# EAGLE design BaseProximity (EAGLE 8.1.0)
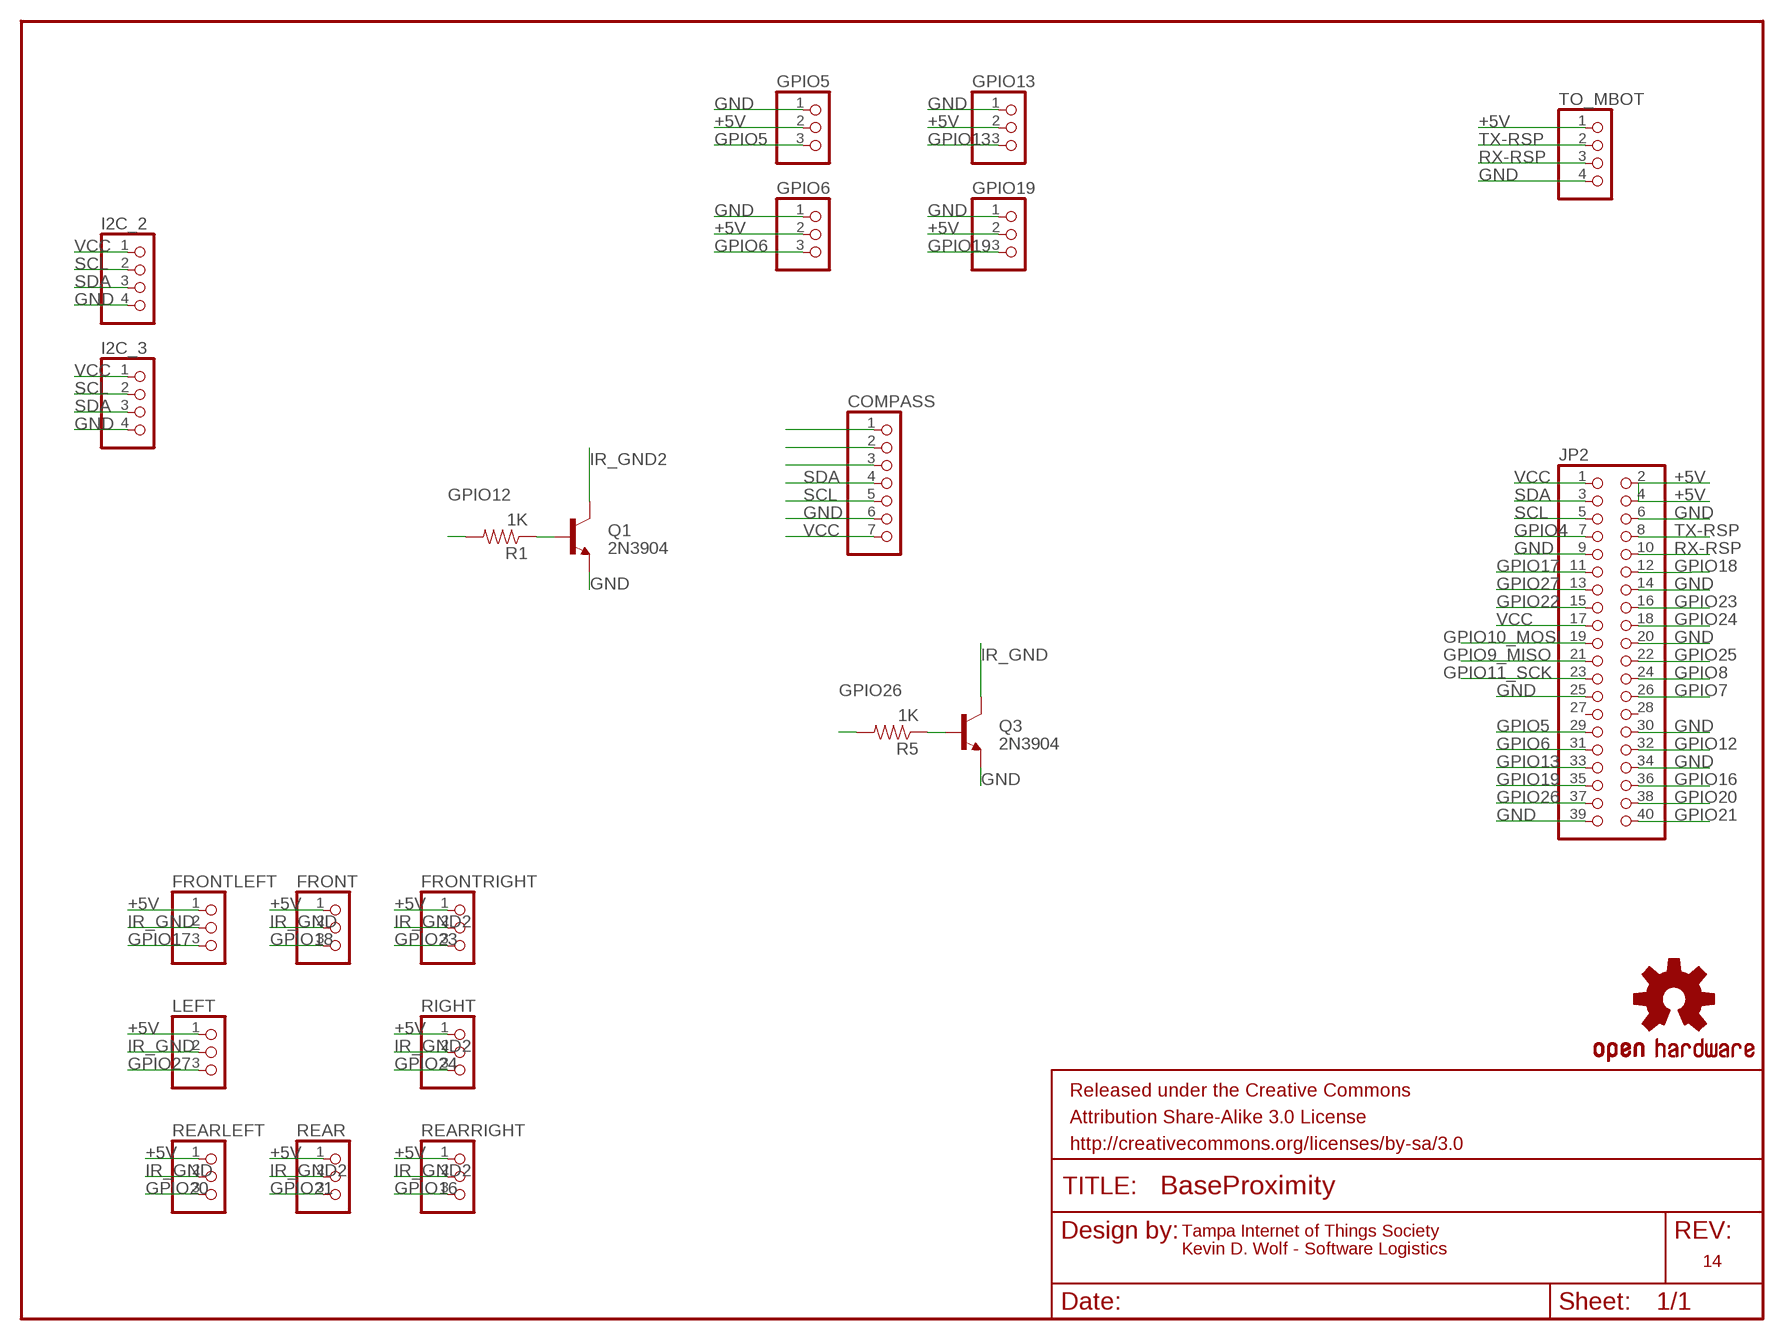
[diagram p0: schematic, sheet 1]

## Parts
COMPASS  PINHD-1X7  [1X07]
FRAME1  FRAME-LETTER  [CREATIVE_COMMONS]
FRONT  PINHD-1X3  [1X03]
FRONTLEFT  PINHD-1X3  [1X03]
FRONTRIGHT  PINHD-1X3  [1X03]
GPIO5  PINHD-1X3  [1X03]
GPIO6  PINHD-1X3  [1X03]
GPIO13  PINHD-1X3  [1X03]
GPIO19  PINHD-1X3  [1X03]
I2C_2  PINHD-1X4  [1X04]
I2C_3  PINHD-1X4  [1X04]
JP2  PINHD-2X20  [2X20]
LEFT  PINHD-1X3  [1X03]
Q1  2N3904  TRANSISTOR_NPN2N3904-EZ  [TO-92-EZ]
Q3  2N3904  TRANSISTOR_NPN2N3904-EZ  [TO-92-EZ]
R1  1K  1KOHM-1/4W-1%(PTH)HORIZ-KIT  [AXIAL-0.3EZ]
R5  1K  1KOHM-1/4W-1%(PTH)HORIZ-KIT  [AXIAL-0.3EZ]
REAR  PINHD-1X3  [1X03]
REARLEFT  PINHD-1X3  [1X03]
REARRIGHT  PINHD-1X3  [1X03]
RIGHT  PINHD-1X3  [1X03]
TO_MBOT  PINHD-1X4  [1X04]
U$3  OSHW-LOGOS  [OSHW-LOGO-S]

## Nets
+5V: FRONT.1 FRONTLEFT.1 FRONTRIGHT.1 GPIO5.2 GPIO6.2 GPIO13.2 GPIO19.2 JP2.2 JP2.4 LEFT.1 REAR.1 REARLEFT.1 REARRIGHT.1 RIGHT.1 TO_MBOT.1
GND [vcc]: COMPASS.6 GPIO5.1 GPIO6.1 GPIO13.1 GPIO19.1 I2C_2.4 I2C_3.4 JP2.6 JP2.9 JP2.14 JP2.20 JP2.25 JP2.30 JP2.34 JP2.39 Q1.1(E) Q3.1(E) TO_MBOT.4
GPIO4: JP2.7
GPIO5: GPIO5.3 JP2.29
GPIO6: GPIO6.3 JP2.31
GPIO7: JP2.26
GPIO8: JP2.24
GPIO9_MISO: JP2.21
GPIO10_MOSI: JP2.19
GPIO11_SCK: JP2.23
GPIO12: JP2.32 R1.P$2
GPIO13: GPIO13.3 JP2.33
GPIO16: JP2.36 REARRIGHT.3
GPIO17: FRONTLEFT.3 JP2.11
GPIO18: FRONT.3 JP2.12
GPIO19: GPIO19.3 JP2.35
GPIO20: JP2.38 REARLEFT.3
GPIO21: JP2.40 REAR.3
GPIO22: JP2.15
GPIO23: FRONTRIGHT.3 JP2.16
GPIO24: JP2.18 RIGHT.3
GPIO25: JP2.22
GPIO26: JP2.37 R5.P$2
GPIO27: JP2.13 LEFT.3
IR_GND: FRONT.2 FRONTLEFT.2 LEFT.2 Q3.3(C) REARLEFT.2
IR_GND2: FRONTRIGHT.2 Q1.3(C) REAR.2 REARRIGHT.2 RIGHT.2
N$1: Q1.2(B) R1.P$1
N$3: Q3.2(B) R5.P$1
N$5: COMPASS.3
N$9: COMPASS.2
N$12: COMPASS.1
RX-RSP: JP2.10 TO_MBOT.3
SCL: COMPASS.5 I2C_2.2 I2C_3.2 JP2.5
SDA: COMPASS.4 I2C_2.3 I2C_3.3 JP2.3
TX-RSP: JP2.8 TO_MBOT.2
VCC: COMPASS.7 I2C_2.1 I2C_3.1 JP2.1 JP2.17
Unconnected: JP2.27 JP2.28

## Notes on the sheet
- Tampa Internet of Things Society
- Kevin D. Wolf - Software Logistics
- 14

## Library data of the parts
COMPASS = pinhead:PINHD-1X7: PIN HEADER
FRAME1 = SparkFun-Aesthetics:FRAME-LETTER: Schematic Frame Standard 8.5x11 US Letter frame
FRONT FRONTLEFT FRONTRIGHT GPIO5 GPIO6 GPIO13 GPIO19 LEFT REAR REARLEFT REARRIGHT RIGHT = pinhead:PINHD-1X3: PIN HEADER
I2C_2 I2C_3 TO_MBOT = pinhead:PINHD-1X4: PIN HEADER
JP2 = pinhead:PINHD-2X20: PIN HEADER
Q1 Q3 = SparkFun-DiscreteSemi:TRANSISTOR_NPN: Generic NPN BJT MMBT2222A - TRANS-08049 (SOT-23, 1A 40V) MPSA42 - TRANS-09116 (SOT-23, 500mA 300V) MMBT5088LT1G - TRANS-11160 (SOT-23, 50 mA 30V) BC547 - COM-08928 <http://www.sparkfun.com/products/8928> (TO-92 45V 100mA) (1.Collector 2.Base 3.Emitter) 2N3904 - COM-00521 <http://www.sparkfun.com/products/521> (TO-92 40V 200mA) (1.Emitter 2.Base 3.Collector) P2N2222A - COM-12852 <http://www.sparkfun.com/products/12852> (TO-92 40V 600mA) (1.Collector 2.Base 3.Emitter); PROD_ID: TRANS-08447
R1 R5 = SparkFun-Resistors:1KOHM-1/4W-1%(PTH): RES-12182; PROD_ID: RES-12182
U$3 = SparkFun:OSHW-LOGO: Open Source Hardware Logo This logo indicates the piece of hardware it is found on incorporates a OSHW license and/or adheres to the definition of open source hardware found here: http://freedomdefined.org/OSHW

## Net classes
0 default: width 0.203 mm
1 vcc: width 0.254 mm

## Board
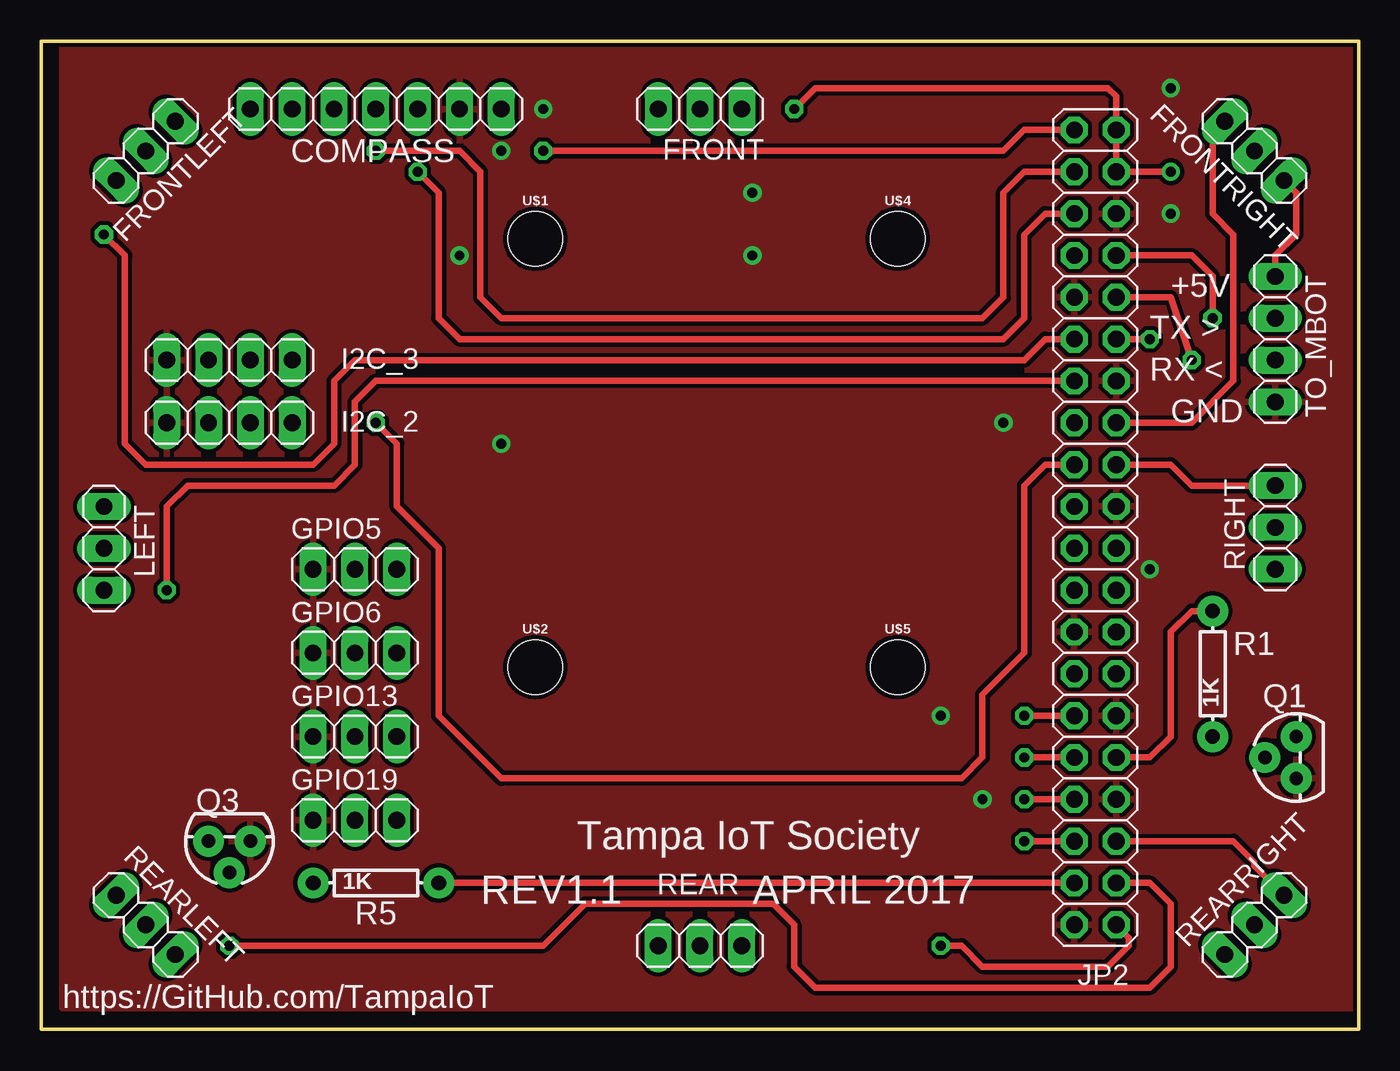
[diagram p1: board, top side]
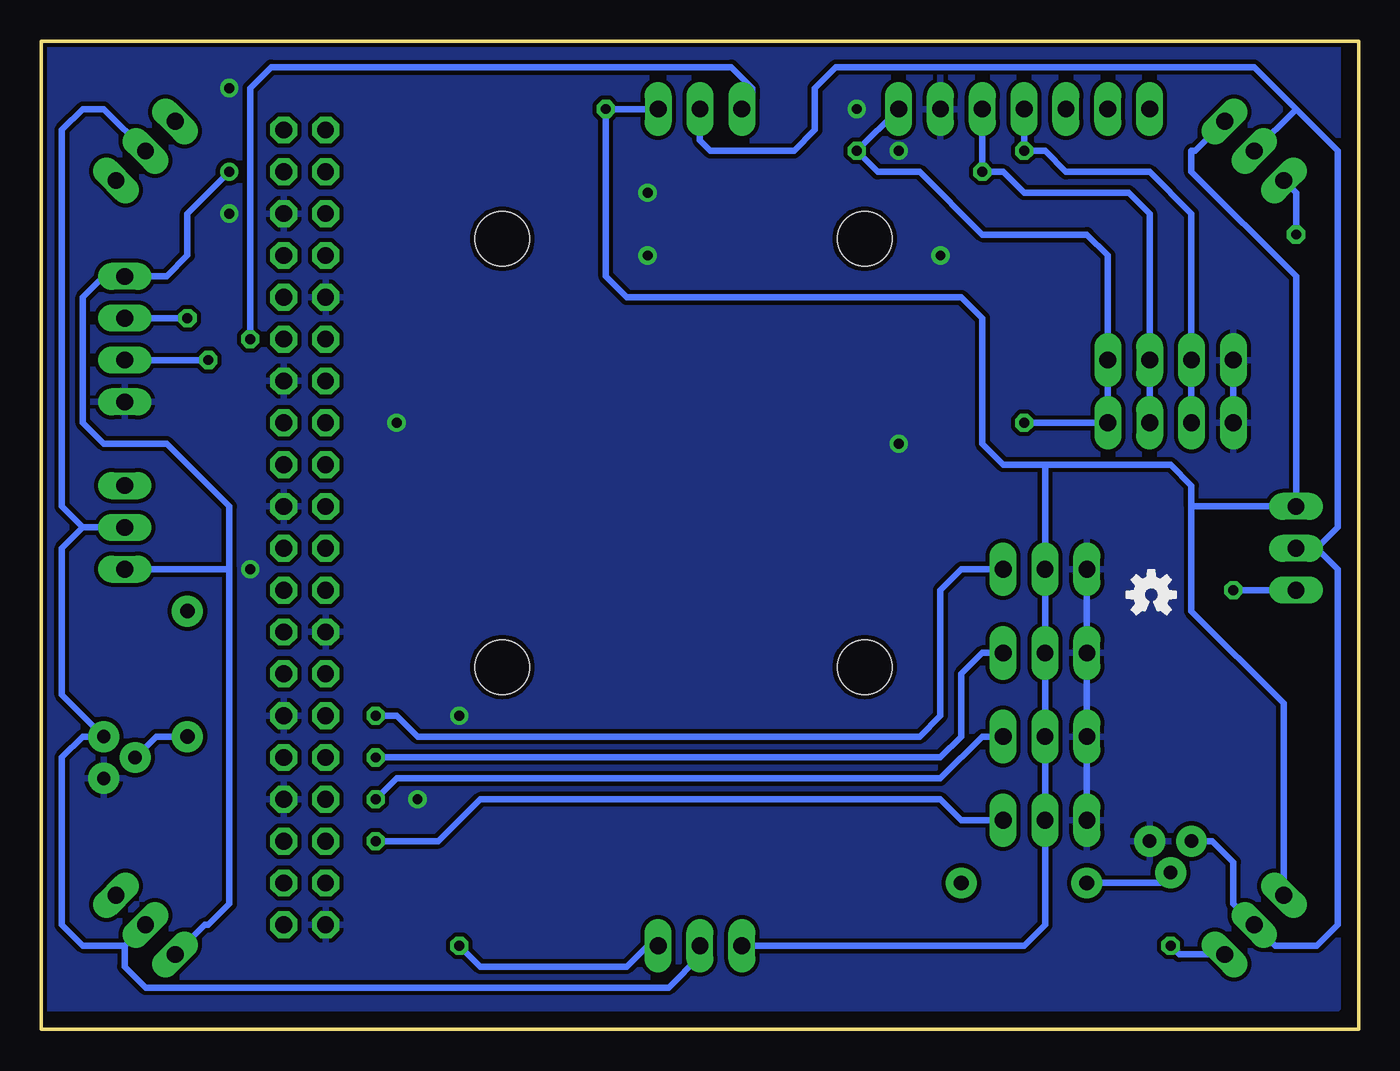
[diagram p2: board, bottom side, seen from below]

Size 80 x 60 mm. Coordinates in mm from the lower left corner, seen from the top.
Outline: 0,60 0,0 80,0 80,60 0,60
Copper layers (1*16): Top 0.035mm / dielectric 2mm / Bottom 0.035mm
Design rules "SparkFun-2-layer *": minimum track width 7mil, minimum drill 15mil, track to track 10mil, track to pad 10mil, pad to pad 8mil, via to via 8mil, smd to smd 8mil, copper to edge 10mil, drill to drill 8mil, minimum pad ring 12mil, minimum via ring 10mil, stop-mask expansion 4mil, vias tented up to drill 20mil, thermal gap 10mil

### Footprints (pad centres in the part's own frame; a part is rotated, then mirrored left to right if it is on the bottom)
1X07 = drill 1.016 long: 1 -7.62,0; 2 -5.08,0; 3 -2.54,0; 4 0,0; 5 2.54,0; 6 5.08,0; 7 7.62,0
1X03 = drill 1.016 long: 1 -2.54,0; 2 0,0; 3 2.54,0
1X04 = drill 1.016 long: 1 -3.81,0; 2 -1.27,0; 3 1.27,0; 4 3.81,0
2X20 = drill 1.016 octagon: 1 -24.13,-1.27; 2 -24.13,1.27; 3 -21.59,-1.27; 4 -21.59,1.27; 5 -19.05,-1.27; 6 -19.05,1.27; 7 -16.51,-1.27; 8 -16.51,1.27; 9 -13.97,-1.27; 10 -13.97,1.27; 11 -11.43,-1.27; 12 -11.43,1.27; 13 -8.89,-1.27; 14 -8.89,1.27; 15 -6.35,-1.27; 16 -6.35,1.27; 17 -3.81,-1.27; 18 -3.81,1.27; 19 -1.27,-1.27; 20 -1.27,1.27; 21 1.27,-1.27; 22 1.27,1.27; 23 3.81,-1.27; 24 3.81,1.27; 25 6.35,-1.27; 26 6.35,1.27; 27 8.89,-1.27; 28 8.89,1.27; 29 11.43,-1.27; 30 11.43,1.27; 31 13.97,-1.27; 32 13.97,1.27; 33 16.51,-1.27; 34 16.51,1.27; 35 19.05,-1.27; 36 19.05,1.27; 37 21.59,-1.27; 38 21.59,1.27; 39 24.13,-1.27; 40 24.13,1.27
TO-92-EZ = drill 0.813 pad 1.88: 1 -1.27,0; 2 0,1.905; 3 1.27,0
AXIAL-0.3EZ = drill 0.9 pad 1.88: P$1 -3.81,0; P$2 3.81,0
STAND-OFF = hole 3.302: 0,0

### Placement (x,y rotation side)
COMPASS  20.32,55.88 0 top
FRAME1  -15.98,-8.89 0 top  (outside the outline)
FRONT  40,55.88 180 top
FRONTLEFT  6.35,53.34 225 top
FRONTRIGHT  73.66,53.34 135 top
GPIO5  19.05,27.94 0 top
GPIO6  19.05,22.86 0 top
GPIO13  19.05,17.78 0 top
GPIO19  19.05,12.7 0 top
I2C_2  11.43,36.83 180 top
I2C_3  11.43,40.64 180 top
JP2  64,30.48 270 top
LEFT  3.81,29.21 270 top
Q1  76.2,16.51 90 top
Q3  11.43,11.43 180 top
R1  71.12,21.59 90 top
R5  20.32,8.89 0 top
REAR  40,5.08 0 top
REARLEFT  6.35,6.35 315 top
REARRIGHT  73.66,6.35 45 top
RIGHT  74.93,30.48 90 top
TO_MBOT  74.93,41.91 270 top
U$1  [STAND-OFF]  30,48 0 top
U$2  [STAND-OFF]  30,22 0 top
U$3  12.6,26.39 0 bottom
U$4  [STAND-OFF]  52,48 0 top
U$5  [STAND-OFF]  52,22 0 top

### Tracks (layer width: path | path; a pad name or v marks a point on that pad's centre or on a via)
+5V  (via drill 0.6)
  Top 0.406: v45.72,55.88 46.99,57.15 64.77,57.15 65.27,56.65 JP2.2 JP2.4 v68.58,52.07 | TO_MBOT.1 74.93,46.99 76.2,48.26 76.2,50.8 FRONTRIGHT.1
  Bottom 0.406: FRONT.1 v45.72,55.88 45.72,45.72 44.45,44.45 24.13,44.45 22.86,43.18 22.86,35.56 21.59,34.29 19.05,34.29 | REARLEFT.1 4.55,19.79 10.16,25.4 10.16,31.75 | REAR.1 20.32,5.08 19.05,6.35 GPIO19.2 GPIO13.2 GPIO6.2 GPIO5.2 19.05,34.29 | FRONTLEFT.1 9.94,53.34 10.16,53.34 10.16,52.07 3.81,45.72 LEFT.1 10.16,31.75 | 19.05,34.29 11.43,34.29 10.16,33.02 10.16,31.75 | REARRIGHT.1 70.07,6.35 69.85,6.35 68.58,7.62 68.58,27.94 | 68.58,27.94 68.58,31.75 72.39,35.56 76.2,35.56 77.47,36.83 77.47,44.45 76.2,45.72 TO_MBOT.1 72.39,45.72 71.12,46.99 71.12,49.53 v68.58,52.07 | RIGHT.1 68.58,27.94
GND  (via drill 0.6)
  Bottom 0.4: I2C_2.4 I2C_3.4 | GPIO19.1 GPIO13.1 GPIO6.1 GPIO5.1
  other vias: 43.18,46.99 27.94,35.56 27.94,53.34 30.48,55.88 25.4,46.99 43.18,50.8 58.42,36.83 67.31,27.94 54.61,19.05 57.15,13.97 68.58,49.53 68.58,57.15
  pour Bottom: 1.27,78.74 97.79,78.74 97.79,76.2 97.79,1.27 1.27,1.27 1.27,2.54
  pour Top: 1.27,78.74 97.79,78.74 97.79,76.2 97.79,1.27 1.27,1.27 1.27,2.54
GPIO5  (via drill 0.6)
  Top 0.406: JP2.29 v59.69,19.05
  Bottom 0.406: GPIO5.3 24.13,27.94 25.4,26.67 25.4,19.05 26.67,17.78 57.15,17.78 58.42,19.05 v59.69,19.05
GPIO6  (via drill 0.6)
  Top 0.406: v59.69,16.51 JP2.31
  Bottom 0.406: GPIO6.3 22.86,22.86 24.13,21.59 24.13,17.78 25.4,16.51 v59.69,16.51
GPIO12
  Top 0.406: JP2.32 67.31,16.51 68.58,17.78 68.58,24.13 69.85,25.4 R1.P$2
GPIO13  (via drill 0.6)
  Top 0.406: JP2.33 v59.69,13.97
  Bottom 0.406: v59.69,13.97 58.42,15.24 25.4,15.24 22.86,17.78 GPIO13.3
GPIO16
  Top 0.406: REARRIGHT.3 73.66,9.94 73.66,10.16 72.39,11.43 JP2.36
GPIO17  (via drill 0.6)
  Top 0.406: v3.81,48.26 5.08,46.99 5.08,35.56 6.35,34.29 16.51,34.29 17.78,35.56 17.78,39.37 19.05,40.64 59.69,40.64 60.96,41.91 JP2.11
  Bottom 0.406: v3.81,48.26 3.81,50.8 FRONTLEFT.3
GPIO18  (via drill 0.6)
  Top 0.406: JP2.12 v67.31,41.91
  Bottom 0.406: v67.31,41.91 67.31,57.15 66.04,58.42 38.1,58.42 36.83,57.15 36.83,56.51 FRONT.3
GPIO19  (via drill 0.6)
  Top 0.406: v59.69,11.43 JP2.35
  Bottom 0.406: GPIO19.3 24.13,12.7 25.4,13.97 53.34,13.97 55.88,11.43 v59.69,11.43
GPIO20  (via drill 0.6)
  Top 0.406: v11.43,5.08 30.48,5.08 33.02,7.62 44.45,7.62 45.72,6.35 45.72,3.81 46.99,2.54 67.31,2.54 68.58,3.81 68.58,7.62 67.31,8.89 JP2.38
  Bottom 0.406: REARLEFT.3 10.9,4.55 v11.43,5.08
GPIO21  (via drill 0.6)
  Top 0.406: v54.61,5.08 55.88,5.08 57.15,3.81 64.77,3.81 66.04,5.08 66.04,5.58 JP2.40
  Bottom 0.406: REAR.3 43.18,5.08 44.45,3.81 53.34,3.81 v54.61,5.08
GPIO23
  Top 0.406: JP2.16 69.85,36.83 72.39,39.37 72.39,48.26 71.12,49.53 71.12,54.39 FRONTRIGHT.3
GPIO24
  Top 0.406: JP2.18 68.58,34.29 69.85,33.02 RIGHT.3
GPIO26
  Top 0.406: R5.P$2 JP2.37
GPIO27  (via drill 0.6)
  Top 0.406: JP2.13 20.32,39.37 19.05,38.1 19.05,34.29 17.78,33.02 8.89,33.02 7.62,31.75 v7.62,26.67
  Bottom 0.406: v7.62,26.67 LEFT.3
IR_GND
  Bottom 0.406: 2.54,29.21 1.27,27.94 1.27,6.35 2.54,5.08 5.08,5.08 REARLEFT.2 7.62,7.62 7.62,10.16 8.89,11.43 Q3.3 | LEFT.2 2.54,29.21 | 2.54,29.21 1.27,30.48 1.27,53.34 3.81,55.88 | 3.81,55.88 FRONTLEFT.2 | 3.81,55.88 6.35,58.42 31.75,58.42 33.02,57.15 33.02,54.61 34.29,53.34 39.37,53.34 40,53.97 FRONT.2
IR_GND2
  Bottom 0.406: REAR.2 40,4.45 41.91,2.54 73.66,2.54 74.93,3.81 74.93,5.08 | REARRIGHT.2 74.93,5.08 | 74.93,5.08 77.47,5.08 78.74,6.35 78.74,16.51 77.47,17.78 Q1.3 78.74,20.32 78.74,29.21 77.47,30.48 | FRONTRIGHT.2 76.2,55.88 77.47,55.88 78.74,54.61 78.74,31.75 77.47,30.48 | 77.47,30.48 RIGHT.2
N$1
  Bottom 0.406: R1.P$1 73.03,17.78 Q1.2
N$3
  Bottom 0.406: R5.P$1 12.06,8.89 Q3.2
RX-RSP  (via drill 0.6)
  Top 0.406: JP2.10 68.58,44.45 v69.85,40.64
  Bottom 0.406: TO_MBOT.3 v69.85,40.64
SCL  (via drill 0.6)
  Top 0.406: v22.86,52.07 24.13,50.8 24.13,43.18 25.4,41.91 58.42,41.91 59.69,43.18 59.69,48.26 60.96,49.53 JP2.5
  Bottom 0.406: I2C_2.2 I2C_3.2 12.7,49.53 13.97,50.8 20.32,50.8 21.59,52.07 v22.86,52.07 COMPASS.5
SDA  (via drill 0.6)
  Top 0.406: v20.32,53.34 25.4,53.34 26.67,52.07 26.67,44.45 27.94,43.18 57.15,43.18 58.42,44.45 58.42,50.8 59.69,52.07 JP2.3
  Bottom 0.406: I2C_2.3 I2C_3.3 10.16,49.53 12.7,52.07 17.78,52.07 19.05,53.34 v20.32,53.34 COMPASS.4
TX-RSP  (via drill 0.6)
  Top 0.406: JP2.8 69.85,46.99 71.12,45.72 v71.12,43.18
  Bottom 0.406: v71.12,43.18 TO_MBOT.2
VCC  (via drill 0.6)
  Top 0.406: v30.48,53.34 58.42,53.34 59.69,54.61 JP2.1 | JP2.17 60.96,34.29 59.69,33.02 59.69,22.86 57.15,20.32 57.15,16.51 55.88,15.24 27.94,15.24 24.13,19.05 24.13,29.21 21.59,31.75 21.59,35.56 v20.32,36.83
  Bottom 0.406: COMPASS.7 v30.48,53.34 29.21,52.07 26.67,52.07 22.86,48.26 16.51,48.26 15.24,46.99 I2C_3.1 I2C_2.1 v20.32,36.83

### Text on the board
tNames: +5V | TX > | RX < | GND | Tampa IoT Society | REV1.1 | APRIL 2017 | https://GitHub.com/TampaIoT
tValues: Arduino Pro Mini
tDocu: Original Arduino Mini Design by Team Arduino / Arduino Pro Mini Design by SparkFun Electronics / Revised by Pete Lewis